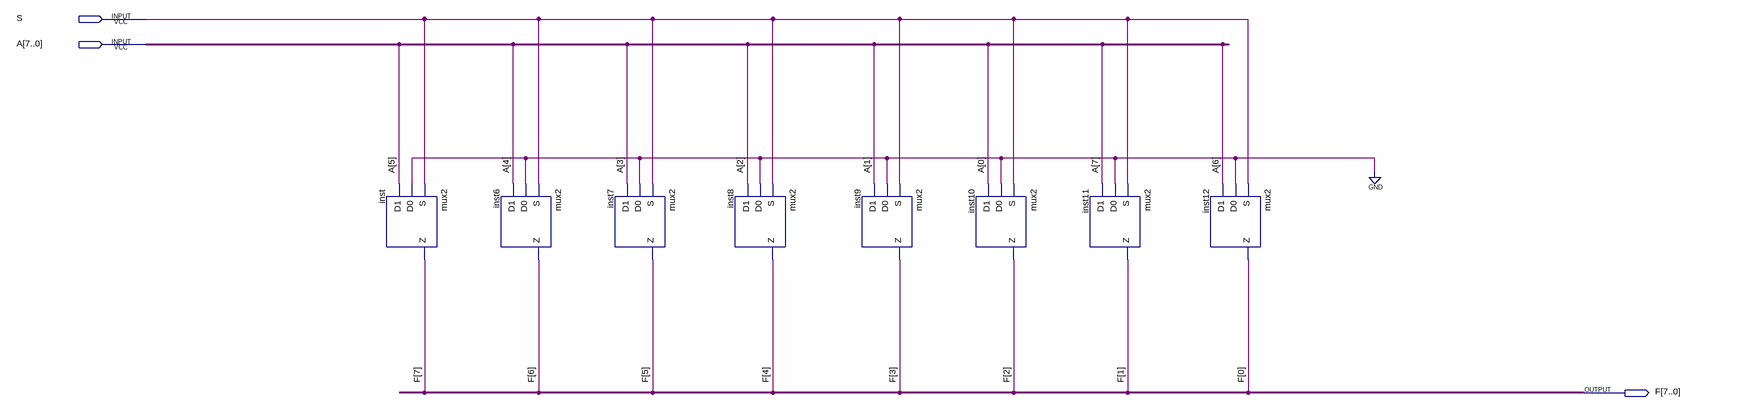
[diagram p0: schematic sheet]
// Quartus schematic shift_2_ver2.bdf as structural Verilog: 8 symbols, 3 pins
module shift_2_ver2 (
  input  S,
  input  [7:0] A,
  output [7:0] F
);

  mux2 inst (.S(S), .D0(1'b0), .D1(A[5]), .Z(F[7]));
  mux2 inst6 (.S(S), .D0(1'b0), .D1(A[4]), .Z(F[6]));
  mux2 inst7 (.S(S), .D0(1'b0), .D1(A[3]), .Z(F[5]));
  mux2 inst8 (.S(S), .D0(1'b0), .D1(A[2]), .Z(F[4]));
  mux2 inst9 (.S(S), .D0(1'b0), .D1(A[1]), .Z(F[3]));
  mux2 inst10 (.S(S), .D0(1'b0), .D1(A[0]), .Z(F[2]));
  mux2 inst11 (.S(S), .D0(1'b0), .D1(A[7]), .Z(F[1]));
  mux2 inst12 (.S(S), .D0(1'b0), .D1(A[6]), .Z(F[0]));
endmodule
